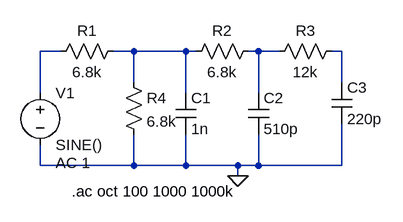
[diagram p0: schematic rds filter.asc]
rds filter.asc, the LTspice schematic file:
Version 4
SHEET 1 880 680
WIRE -80 64 -112 64
WIRE 32 64 0 64
WIRE 112 64 32 64
WIRE 128 64 112 64
WIRE 224 64 208 64
WIRE 256 64 224 64
WIRE 352 64 336 64
WIRE 32 112 32 64
WIRE 352 112 352 64
WIRE -112 128 -112 64
WIRE 112 128 112 64
WIRE 224 128 224 64
WIRE -112 240 -112 208
WIRE 32 240 32 192
WIRE 32 240 -112 240
WIRE 112 240 112 192
WIRE 112 240 32 240
WIRE 192 240 112 240
WIRE 224 240 224 192
WIRE 224 240 192 240
WIRE 352 240 352 176
WIRE 352 240 224 240
WIRE 192 256 192 240
FLAG 192 256 0
SYMBOL voltage -112 112 R0
WINDOW 123 24 124 Left 2
WINDOW 39 0 0 Left 2
SYMATTR Value2 AC 1
SYMATTR InstName V1
SYMATTR Value SINE()
SYMBOL res 16 48 R90
WINDOW 0 0 56 VBottom 2
WINDOW 3 32 56 VTop 2
SYMATTR InstName R1
SYMATTR Value 6.8k
SYMBOL cap 96 128 R0
SYMATTR InstName C1
SYMATTR Value 1n
SYMBOL res 224 48 R90
WINDOW 0 0 56 VBottom 2
WINDOW 3 32 56 VTop 2
SYMATTR InstName R2
SYMATTR Value 6.8k
SYMBOL cap 208 128 R0
SYMATTR InstName C2
SYMATTR Value 510p
SYMBOL res 352 48 R90
WINDOW 0 0 56 VBottom 2
WINDOW 3 32 56 VTop 2
SYMATTR InstName R3
SYMATTR Value 12k
SYMBOL cap 336 112 R0
SYMATTR InstName C3
SYMATTR Value 220p
SYMBOL res 16 96 R0
SYMATTR InstName R4
SYMATTR Value 6.8k
TEXT -64 280 Left 2 !.ac oct 100 1000 1000k

The netlist it stands for:
* rds filter.asc
V1 N001 0 SINE() AC 1
R1 N002 N001 6.8k
C1 N002 0 1n
R2 N003 N002 6.8k
C2 N003 0 510p
R3 N004 N003 12k
C3 N004 0 220p
R4 N002 0 6.8k
.ac oct 100 1000 1000k
.backanno
.end